# EAGLE design UPS BOARD (EAGLE 9.6.2)
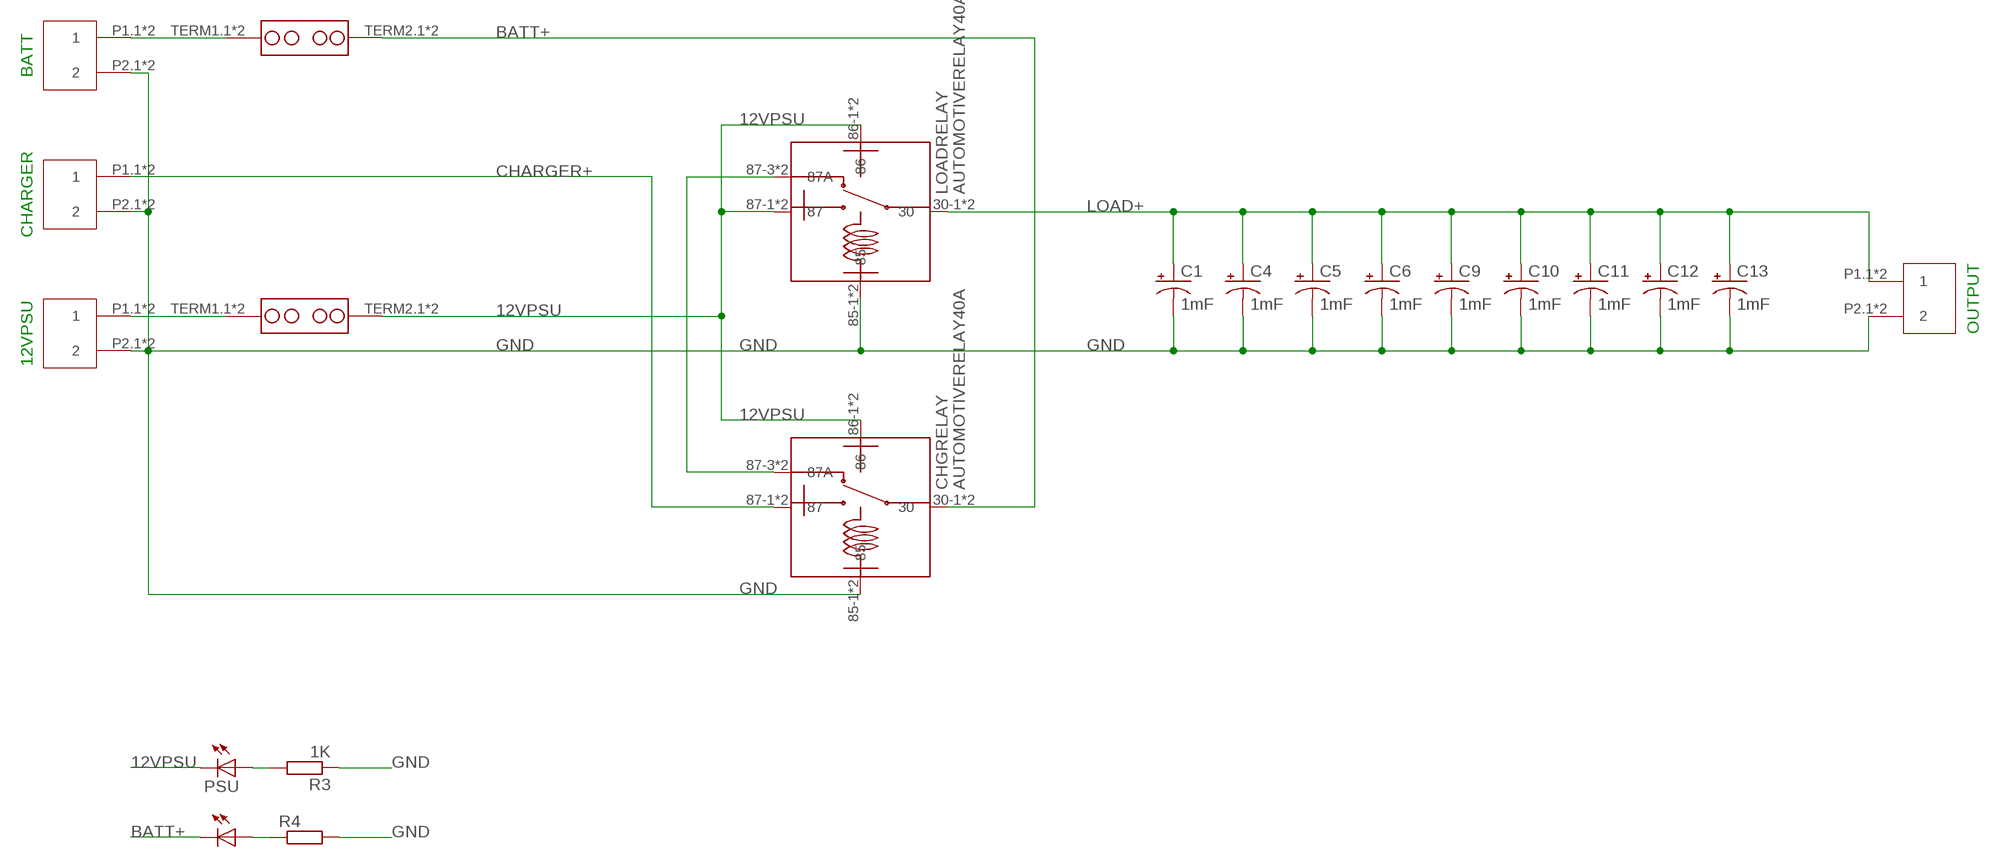
[diagram p0: schematic, sheet 1]

## Parts
BATT  LED5MM  [LED5MM]
C1  1mF  1000UF-RADIAL-5MM-25V-20%  [CPOL-RADIAL-5MM-10MM]
C4  1mF  1000UF-RADIAL-5MM-25V-20%  [CPOL-RADIAL-5MM-10MM]
C5  1mF  1000UF-RADIAL-5MM-25V-20%  [CPOL-RADIAL-5MM-10MM]
C6  1mF  1000UF-RADIAL-5MM-25V-20%  [CPOL-RADIAL-5MM-10MM]
C9  1mF  1000UF-RADIAL-5MM-25V-20%  [CPOL-RADIAL-5MM-10MM]
C10  1mF  1000UF-RADIAL-5MM-25V-20%  [CPOL-RADIAL-5MM-10MM]
C11  1mF  1000UF-RADIAL-5MM-25V-20%  [CPOL-RADIAL-5MM-10MM]
C12  1mF  1000UF-RADIAL-5MM-25V-20%  [CPOL-RADIAL-5MM-10MM]
C13  1mF  1000UF-RADIAL-5MM-25V-20%  [CPOL-RADIAL-5MM-10MM]
CHARGER2  BARRIERTERMINAL  [BARRIERTERMINAL]
CHARGER3  BARRIERTERMINAL  [BARRIERTERMINAL]
CHARGER4  BARRIERTERMINAL  [BARRIERTERMINAL]
CHARGER5  BARRIERTERMINAL  [BARRIERTERMINAL]
CHGRELAY  AUTOMOTIVERELAY40A  [AUTOMOTIVERELAY40A]
LOADRELAY  AUTOMOTIVERELAY40A  [AUTOMOTIVERELAY40A]
PSU  LED5MM  [LED5MM]
R3  1K  R-EU_0204/7  [0204/7]
R4  1K  R-EU_0204/7  [0204/7]
U$15  ATQ-FUSE  [ATQ-FUSE]
U$17  ATQ-FUSE  [ATQ-FUSE]

## Nets
12VPSU: CHGRELAY.86-1 CHGRELAY.86-2 LOADRELAY.86-1 LOADRELAY.86-2 LOADRELAY.87-1 LOADRELAY.87-2 PSU.K(C) U$17.TERM2.1 U$17.TERM2.2
BATT+: BATT.K(C) CHGRELAY.30-1 CHGRELAY.30-2 U$15.TERM2.1 U$15.TERM2.2
CHARGER+: CHARGER5.P1.1 CHARGER5.P1.2 CHGRELAY.87-1 CHGRELAY.87-2
GND: C1.- C4.- C5.- C6.- C9.- C10.- C11.- C12.- C13.- CHARGER2.P2.1 CHARGER2.P2.2 CHARGER3.P2.1 CHARGER3.P2.2 CHARGER4.P2.1 CHARGER4.P2.2 CHARGER5.P2.1 CHARGER5.P2.2 CHGRELAY.85-1 CHGRELAY.85-2 LOADRELAY.85-1 LOADRELAY.85-2 R3.1 R4.2
LOAD+: C1.+ C4.+ C5.+ C6.+ C9.+ C10.+ C11.+ C12.+ C13.+ CHARGER4.P1.1 CHARGER4.P1.2 LOADRELAY.30-1 LOADRELAY.30-2
N$2: PSU.A R3.2
N$5: BATT.A R4.1
N$16: CHARGER3.P1.1 CHARGER3.P1.2 U$17.TERM1.1 U$17.TERM1.2
N$22: CHGRELAY.87-3(87A) CHGRELAY.87-4(87A) LOADRELAY.87-3(87A) LOADRELAY.87-4(87A)
N$28: CHARGER2.P1.1 CHARGER2.P1.2 U$15.TERM1.1 U$15.TERM1.2

## Notes on the sheet
- BATT
- CHARGER
- OUTPUT
- 12VPSU

## Library data of the parts
BATT PSU = RepRapjr:LED: LED OSRAM: - CHIPLED LG R971, LG N971, LY N971, LG Q971, LY Q971, LO R971, LY R971 LH N974, LH R974 LS Q976, LO Q976, LY Q976 LO Q996 - Hyper CHIPLED LW Q18S LB Q993, LB Q99A, LB R99A - SideLED LS A670, LO A670, LY A670, LG A670, LP A670 LB A673, LV A673, LT A673, LW A673 LH A674 LY A675 LS A676, LA A676, LO A676, LY A676, LW A676 LS A679, LY A679, LG A679 - Hyper Micro SIDELED® LS Y876, LA Y876, LO Y876, LY Y876 LT Y87S - SmartLED LW L88C, LW L88S LB L89C, LB L89S, LG L890 LS L89K, LO L89K, LY L89K LS L896, LA L896, LO L896, LY L896 - TOPLED LS T670, LO T670, LY T670, LG T670, LP T670 LSG T670, LSP T670, LSY T670, LOP T670, LYG T670 LG T671, LOG T671, LSG T671 LB T673, LV T673, LT T673, LW T673 LH T674 LS T676, LA T676, LO T676, LY T676, LB T676, LH T676, LSB T676, LW T676 LB T67C, LV T67C, LT T67C, LS T67K, LO T67K, LY T67K, LW E67C LS E67B, LA E67B, LO E67B, LY E67B, LB E67C, LV E67C, LT E67C LW T67C LS T679, LY T679, LG T679 LS T770, LO T770, LY T770, LG T770, LP T770 LB T773, LV T773, LT T773, LW T773 LH T774 LS E675, LA E675, LY E675, LS T675 LS T776, LA T776, LO T776, LY T776, LB T776 LHGB T686 LT T68C, LB T68C - Hyper Mini TOPLED® LB M676 - Mini TOPLED Santana® LG M470 LS M47K, LO M47K, LY M47K Source: http://www.osram.convergy.de LUXEON: - LUMILED® LXK2-PW12-R00, LXK2-PW12-S00, LXK2-PW14-U00, LXK2-PW14-V00 LXK2-PM12-R00, LXK2-PM12-S00, LXK2-PM14-U00 LXK2-PE12-Q00, LXK2-PE12-R00, LXK2-PE12-S00, LXK2-PE14-T00, LXK2-PE14-U00 LXK2-PB12-K00, LXK2-PB12-L00, LXK2-PB12-M00, LXK2-PB14-N00, LXK2-PB14-P00, LXK2-PB14-Q00 LXK2-PR12-L00, LXK2-PR12-M00, LXK2-PR14-Q00, LXK2-PR14-R00 LXK2-PD12-Q00, LXK2-PD12-R00, LXK2-PD12-S00 LXK2-PH12-R00, LXK2-PH12-S00 LXK2-PL12-P00, LXK2-PL12-Q00, LXK2-PL12-R00 Source: www.luxeon.com KINGBRIGHT: KA-3528ASYC Source: www.kingbright.com
C1 C4-C6 C9-C13 = SparkFun-Capacitors:1000UF: 1,000µF/1mF ceramic capacitors A capacitor is a passive two-terminal electrical component used to store electrical energy temporarily in an electric field. CAP-08070; PROD_ID: CAP-09538
CHARGER2-CHARGER5 = Barrier Terminals 2 pin:BARRIERTERMINAL
CHGRELAY LOADRELAY = AUTOMOTIVERELAYS:AUTOMOTIVERELAY40A
R3 R4 = rcl:R-EU_: RESISTOR, European symbol
U$15 U$17 = ATQ Fuse Holder out of 4.3mm pcb terminals:ATQ-FUSE

## Net classes
0 default: width 0.203 mm, clearance 0.152 mm
1 power: width 0.6 mm, clearance 0.305 mm

## Board
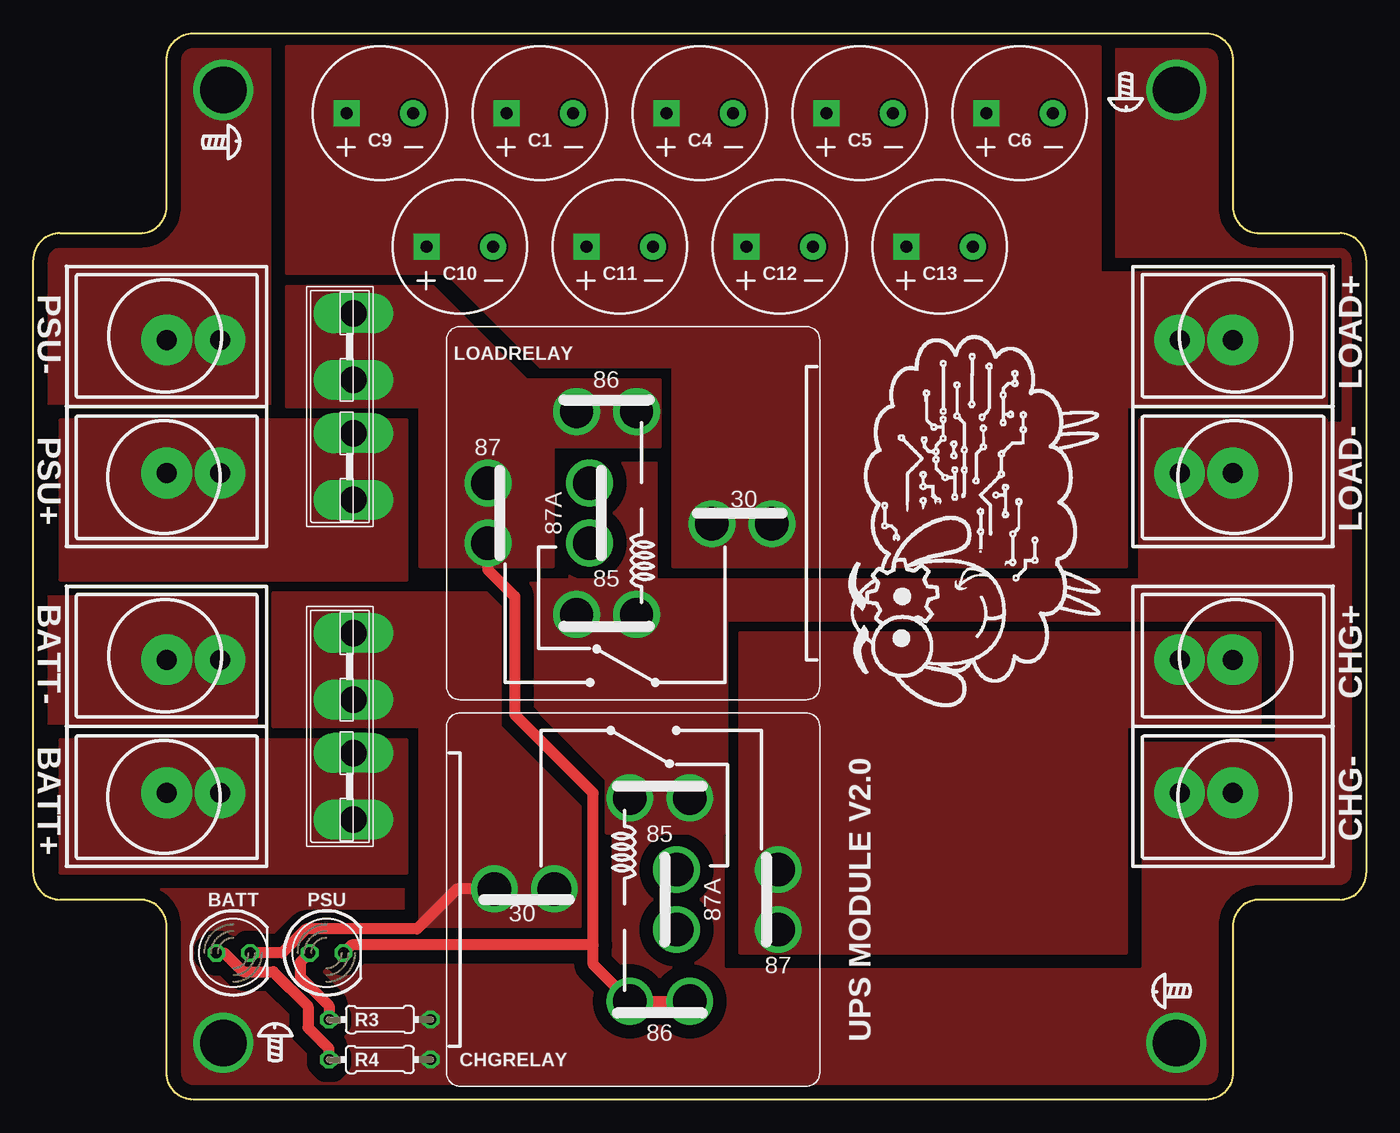
[diagram p1: board, top side]
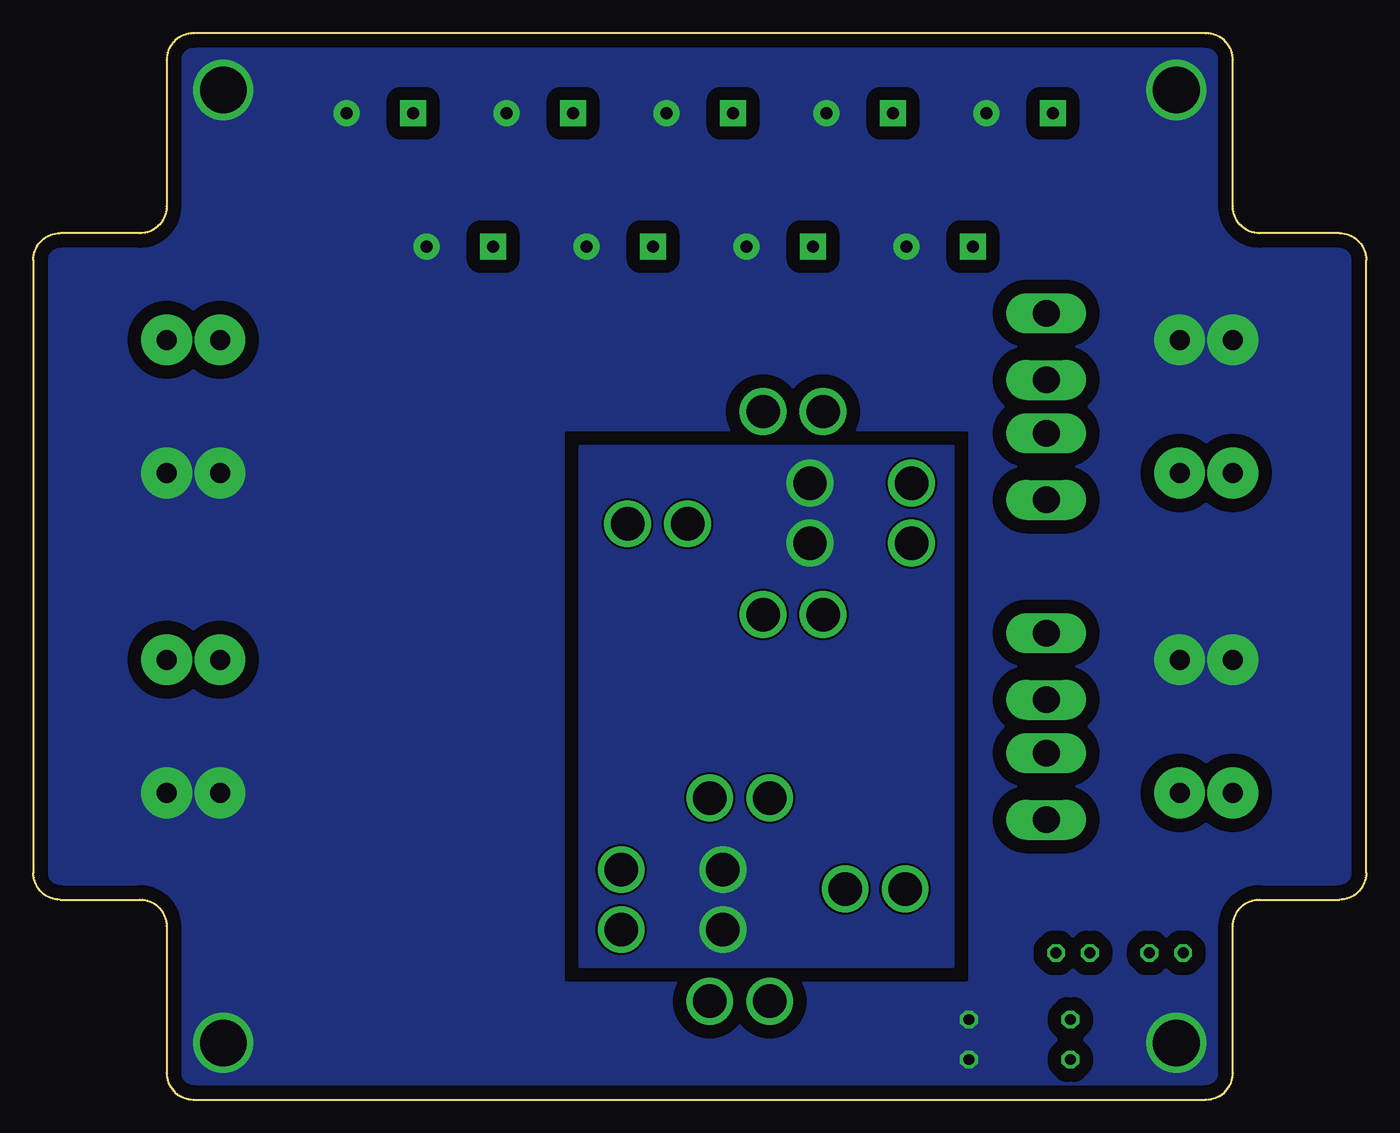
[diagram p2: board, bottom side, seen from below]

Size 100 x 80 mm. Coordinates in mm from the lower left corner, seen from the top.
Outline: 10,2 10,13 arc90 8,15 2,15 arc-90 0,17 0,63 arc-90 2,65 8,65 arc90 10,67 10,78 arc-90 12,80 88,80 arc-90 90,78 90,67 arc90 92,65 98,65 arc-90 100,63 100,17 arc-90 98,15 92,15 arc90 90,13 90,2 arc-90 88,0 12,0 arc-90 10,2
Copper layers (1*16): Top 0.035mm / dielectric 1.5mm / Bottom 0.035mm
Design rules "dirt_cheap_dirty_boards.v1": minimum track width 5mil, minimum drill 12mil, track to track 5mil, track to pad 5mil, pad to pad 5mil, via to via 5mil, smd to smd 0mil, copper to edge 10mil, drill to drill 10mil, minimum pad ring 10mil, minimum via ring 6mil, stop-mask expansion 2mil, vias tented up to drill 25mil, thermal gap 10mil

### Footprints (pad centres in the part's own frame; a part is rotated, then mirrored left to right if it is on the bottom)
LED5MM = drill 0.813 octagon: A -1.27,0; K 1.27,0
CPOL-RADIAL-5MM-10MM = drill 0.9 pad 1.93 square: + 2.5,0 | drill 0.9 pad 1.93: - -2.5,0
BARRIERTERMINAL = drill 1.5 pad 3.81: P1.1 -5,0; P1.2 -5,-4; P2.1 5,0; P2.2 5,-4
AUTOMOTIVERELAY40A = drill 2.5: 30-1 -0.8,-7.91; 30-2 -0.8,-12.41; 85-1 -7.62,2.25; 85-2 -7.62,-2.25; 86-1 7.62,2.25; 86-2 7.62,-2.25; 87-1 -2.25,8.89; 87-2 2.25,8.89; 87-3 -2.25,1.27; 87-4 2.25,1.27
0204/7 = drill 0.813 octagon: 1 -3.81,0; 2 3.81,0
ATQ-FUSE = drill 2 long: TERM1.1 -7,0; TERM1.2 -2,0; TERM2.1 2,0; TERM2.2 7,0

### Placement (x,y rotation side)
BATT  15,11 0 top
C1  38,74 180 top
C4  50,74 180 top
C5  62,74 180 top
C6  74,74 180 top
C9  26,74 180 top
C10  32,64 180 top
C11  44,64 180 top
C12  56,64 180 top
C13  68,64 180 top
CHARGER2  10,28 90 top
CHARGER3  10,52 90 top
CHARGER4  90,52 270 top
CHARGER5  90,28 270 top
CHGRELAY  47,15 270 top
LOADRELAY  43,44 90 top
PSU  22,11 0 top
R3  26,6 180 top
R4  26,3 0 top
U$15  24,28 90 top
U$17  24,52 90 top

### Tracks (layer width: path | path; a pad name or v marks a point on that pad's centre or on a via)
12VPSU
  Top 0.813: CHGRELAY.86-1 CHGRELAY.86-2 42,10.13 42,11.6 | LOADRELAY.87-1 34.11,39.75 36.11,37.75 36.11,28.89 42,23 42,11.6 | 42,11.6 23.87,11.6 PSU.K
  pour Top (no thermals): 19,52 29,52 29,40 39,40 39,49 47,49 47,54 37,54 30,61 19,61
BATT+
  Top 0.813: CHGRELAY.30-2 31.79,15.8 28.79,12.8 20.47,12.8 18.67,11 BATT.K
  pour Top (no thermals): 29,13 41,13 41,22 35,28 35,37 34,38 18,38 18,28 29,28
CHARGER+
  pour Top (no thermals): 53,35 53,11 82,11 82,28 92,28 92,35
GND  (via drill 3.5)
  other vias: 14.25,4.25 85.75,4.25 85.75,75.75 14.25,75.75
  pour Top (rank 2, no thermals): 97,51 83,51 83,39 38,39 38,29 43,24 43,20 52,20 52,36 97,36
  pour Bottom (isolate 1.016, rank 6, no thermals): 9,65 10,66 10,78 12,80 88,80 90,78 90,67 92,65 97,65 98,65 100,63 100,17 98,15 92,15 90,13 90,2 88,0 12,0 10,2 10,13 8,15 2,15 0,17 0,63 2,65
  pour Top (isolate 1.016, rank 6, no thermals): 9,65 10,66 10,78 12,80 88,80 90,78 90,67 92,65 97,65 98,65 100,63 100,17 98,15 92,15 90,13 90,2 88,0 12,0 10,2 10,13 8,15 2,15 0,17 0,63 2,65
LOAD+
  pour Top (no thermals): 19,62 31,62 38,55 48,55 48,40 82,40 82,52 97,52 97,62 80,62 80,79 19,79
N$2
  Top 0.813: PSU.A 20.03,10.3 20.03,9.2 22.19,7.04 R3.2
N$5
  Top 0.813: BATT.A 14.33,11 15.73,9.6 18,9.6 20.6,7 20.6,5.4 22.19,3.81 R4.1
N$16
  pour Top (no thermals): 2,51 28,51 28,39 2,39
N$22
  pour Bottom (rank 2, no thermals): 31,49 31,10 59,10 59,49
N$28
  pour Top (no thermals): 2,27 28,27 28,17 2,17

### Text on the board
tPlace: LOAD+ | PSU- | LOAD- | PSU+ | CHG+ | BATT- | CHG- | BATT+ | UPS MODULE V2.0